# EAGLE schematic clap (EAGLE 6.5.0)
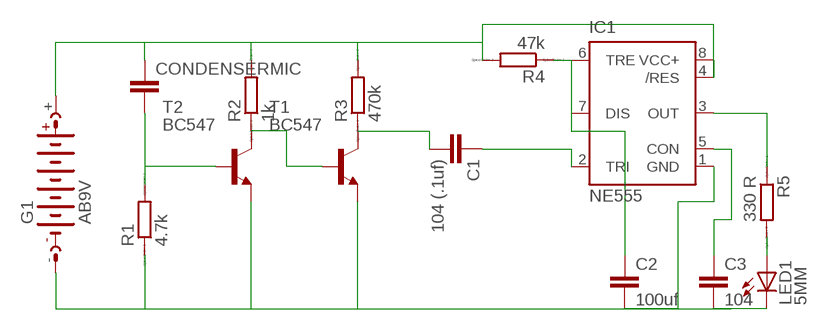
[diagram p0: schematic, sheet 1]

## Parts
C1  104 (.1uf)  C2.5/4  [C2.5-4]
C2  100uf  C2.5/5  [C2.5-5]
C3  104  C2.5/2  [C2.5-2]
CONDENSERMIC  C2.5/4  [C2.5-4]
G1  AB9V  [AB9V]
IC1  NE555  [DIL-08]
LED1  5MM  LED5MM  [LED5MM]
R1  4.7k  R0207/10  [0207/10]
R2  1k  R0207/10  [0207/10]
R3  470k  R0207/10  [0207/10]
R4  47k  R0207/10  [0207/10]
R5  330 R  R0207/10  [0207/10]
T1  BC547  [TO92]
T2  BC547  [TO92]

## Nets
N$1: R2.1 T1.2(B) T2.3(C)
N$2: C1.2 R3.1 T1.3(C)
N$3: C2.1 IC1.6(TRE) IC1.7(DIS) R4.1
N$4: CONDENSERMIC.1 G1.+ IC1.4(/RES) IC1.8(VCC+) R2.2 R3.2 R4.2
N$5: CONDENSERMIC.2 R1.2 T2.2(B)
N$6: C3.1 IC1.5(CON)
N$7: LED1.A R5.2
N$8: C2.2 C3.2 G1.- IC1.1(GND) LED1.K(C) R1.1 T1.1(E) T2.1(E)
N$9: C1.1 IC1.2(TRI)
N$10: IC1.3(OUT) R5.1

## Library data of the parts
C1-C3 CONDENSERMIC = capacitor-wima:C: CAPACITOR naming: grid - package width
G1 = battery:AB9V: 9-V BATTERY CLIP
IC1 = st-microelectronics:NE555: General purpose bipolar Timer; MF: Arrow Electronics; MPN: NE555N; OC_FARNELL: 1467742; OC_NEWARK: 89K1486
LED1 = led:LED: LED OSRAM: - CHIPLED LG R971, LG N971, LY N971, LG Q971, LY Q971, LO R971, LY R971 LH N974, LH R974 LS Q976, LO Q976, LY Q976 LO Q996 - Hyper CHIPLED LW Q18S LB Q993, LB Q99A, LB R99A - SideLED LS A670, LO A670, LY A670, LG A670, LP A670 LB A673, LV A673, LT A673, LW A673 LH A674 LY A675 LS A676, LA A676, LO A676, LY A676, LW A676 LS A679, LY A679, LG A679 - Hyper Micro SIDELED® LS Y876, LA Y876, LO Y876, LY Y876 LT Y87S - SmartLED LW L88C, LW L88S LB L89C, LB L89S, LG L890 LS L89K, LO L89K, LY L89K LS L896, LA L896, LO L896, LY L896 - TOPLED LS T670, LO T670, LY T670, LG T670, LP T670 LSG T670, LSP T670, LSY T670, LOP T670, LYG T670 LG T671, LOG T671, LSG T671 LB T673, LV T673, LT T673, LW T673 LH T674 LS T676, LA T676, LO T676, LY T676, LB T676, LH T676, LSB T676, LW T676 LB T67C, LV T67C, LT T67C, LS T67K, LO T67K, LY T67K, LW E67C LS E67B, LA E67B, LO E67B, LY E67B, LB E67C, LV E67C, LT E67C LW T67C LS T679, LY T679, LG T679 LS T770, LO T770, LY T770, LG T770, LP T770 LB T773, LV T773, LT T773, LW T773 LH T774 LS E675, LA E675, LY E675, LS T675 LS T776, LA T776, LO T776, LY T776, LB T776 LHGB T686 LT T68C, LB T68C - Hyper Mini TOPLED® LB M676 - Mini TOPLED Santana® LG M470 LS M47K, LO M47K, LY M47K Source: http://www.osram.convergy.de LUXEON: - LUMILED® LXK2-PW12-R00, LXK2-PW12-S00, LXK2-PW14-U00, LXK2-PW14-V00 LXK2-PM12-R00, LXK2-PM12-S00, LXK2-PM14-U00 LXK2-PE12-Q00, LXK2-PE12-R00, LXK2-PE12-S00, LXK2-PE14-T00, LXK2-PE14-U00 LXK2-PB12-K00, LXK2-PB12-L00, LXK2-PB12-M00, LXK2-PB14-N00, LXK2-PB14-P00, LXK2-PB14-Q00 LXK2-PR12-L00, LXK2-PR12-M00, LXK2-PR14-Q00, LXK2-PR14-R00 LXK2-PD12-Q00, LXK2-PD12-R00, LXK2-PD12-S00 LXK2-PH12-R00, LXK2-PH12-S00 LXK2-PL12-P00, LXK2-PL12-Q00, LXK2-PL12-R00 Source: www.luxeon.com KINGBRIGHT: KA-3528ASYC Source: www.kingbright.com
R1-R5 = eagle-ltspice:R: RESISTOR, European symbol; SPICEMODEL: NONE; SPICEPREFIX: R
T1 T2 = transistor:BC547: NPN TRANSISTOR